# EasyEDA Pro project self-balancing-robot.epro

# Schematic Schematic1
Board Name: Board1; Create Date: 2024-11-16; Page Name: P1; Project Name: self balancing robot; Schematic Name: Schematic1; Update Date: 2024-11-18; Company: EasyEDA.com; Drawn: EasyEDA; Page Size: A4; Part Number: JLCPCB-002; Reviewed: EasyEDA; Version: V0.1
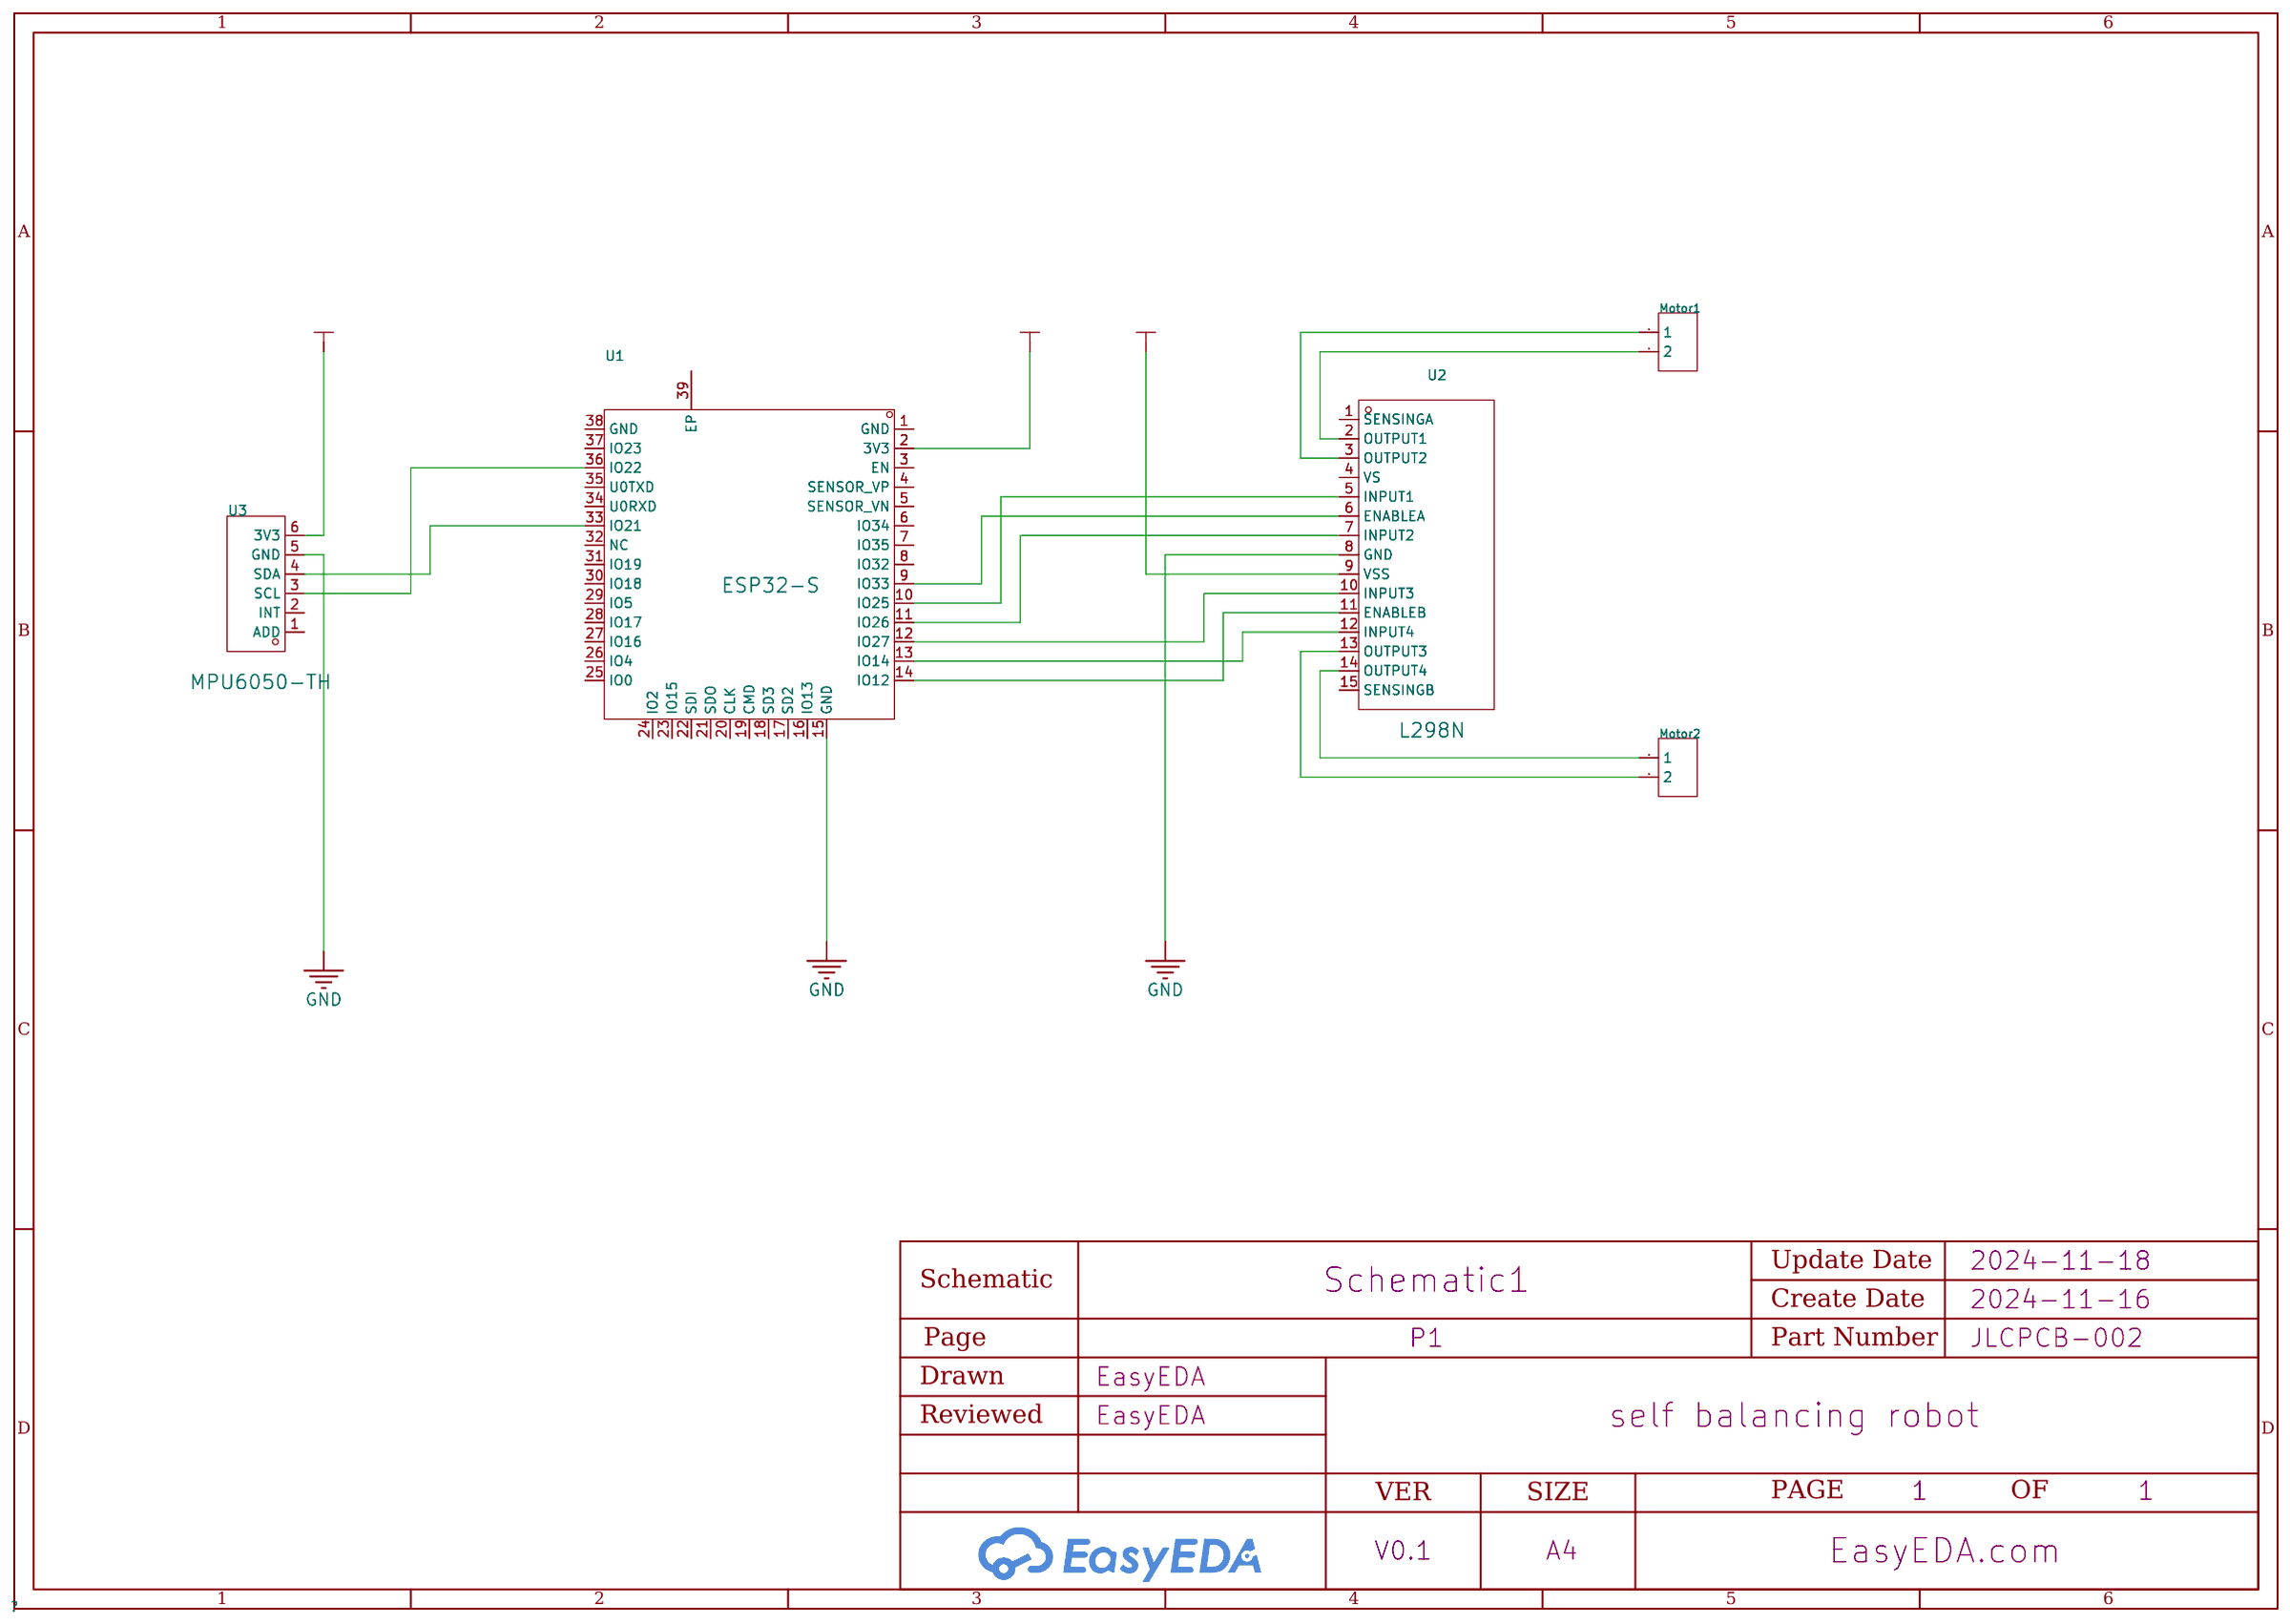
[diagram p0: schematic sheet]

## Parts
Motor1  -  [HDR-TH_2P-P2.54-V-F]
Motor2  -  [HDR-TH_2P-P2.54-V-F]
U1  2.4GHz  [WIRELM-SMD_ESP32-S]
U2  L298N  [MULTIWATT-15_L19.6-W5.0-P1.27-L]
U3  MPU6050-TH  [COMM-TH_MPU6050-TH]

## Library data of the parts
Motor1 Motor2 = HDR-F_2.54_1x2P: Supplier Footprint: Through
U1 = ESP32-S: Core Processor:ESP32芯片 Wireless Standard:- Support Interface:I2C；UART；DAC；SPI；PWM；ADC Frequency:2.4GHz Antenna Type:IPEX接口 Output Power:17dBm Output Power:17dBm Operating Voltage:3.3V Operating Voltage:3.3V Receive  Current:- Send  Current:- Sensitivity:-; Supplier Part: C277944; Manufacturer: Ai-Thinker(安信可); Supplier Footprint: SMD; JLCPCB Part Class: Extended Part; Datasheet: https://atta.szlcsc.com/upload/public/pdf/source/20211217/F4BEA33E732D6002D10DAED85BBCB52B.pdf; Supplier: LCSC; Core Processor: ESP32芯片; Support Interface: I2C；UART；DAC；SPI；PWM；ADC; Antenna Type: IPEX接口; Output Power: 17dBm; Operating Voltage: 3.3V; Sensitivity: -90dBm; Operating Temperature: -40℃~+85℃
U2 = L298N: Supplier Part: C504386; Supplier Footprint: Multiwatt-15; JLCPCB Part Class: Extended Part; Datasheet: https://atta.szlcsc.com/upload/public/pdf/source/20200327/C504386_BB56E557909DA61C724DC028E8A3599A.pdf; Supplier: LCSC
U3 = MPU6050-TH: Supplier Part: C9900132629; Supplier Footprint: 直插; Supplier: LCSC

## Nets
3.3V: U1.2(3V3) U3.6(3V3)
7.4V: U2.9(VSS)
GND: U1.15(GND) U2.8(GND) U3.5(GND)
Net-(Motor1-1): Motor1.1 U2.3(OUTPUT2)
Net-(Motor1-2): Motor1.2 U2.2(OUTPUT1)
Net-(Motor2-1): Motor2.1 U2.14(OUTPUT4)
Net-(Motor2-2): Motor2.2 U2.13(OUTPUT3)
Net-(U1-9): U1.9(IO33) U2.6(ENABLEA)
Net-(U1-10): U1.10(IO25) U2.5(INPUT1)
Net-(U1-11): U1.11(IO26) U2.7(INPUT2)
Net-(U1-12): U1.12(IO27) U2.10(INPUT3)
Net-(U1-13): U1.13(IO14) U2.12(INPUT4)
Net-(U1-14): U1.14(IO12) U2.11(ENABLEB)
Net-(U1-33): U1.33(IO21) U3.4(SDA)
Net-(U1-36): U1.36(IO22) U3.3(SCL)

Not connected (* = marked no-connect by the designer): U1 1(GND) 3(EN) 4(SENSOR_VP) 5(SENSOR_VN) 6(IO34) 7(IO35) 8(IO32) 16(IO13) 17(SD2) 18(SD3) 19(CMD) 20(CLK) 21(SDO) 22(SDI) 23(IO15) 24(IO2) 25(IO0) 26(IO4) 27(IO16) 28(IO17) 29(IO5) 30(IO18) 31(IO19) 32(NC) 34(U0RXD) 35(U0TXD) 37(IO23) 38(GND) 39(EP); U2 1(SENSINGA) 4(VS) 15(SENSINGB); U3 1(ADD) 2(INT)
